# EasyEDA Pro project ACS DIN Controller.eprj, board Main Board
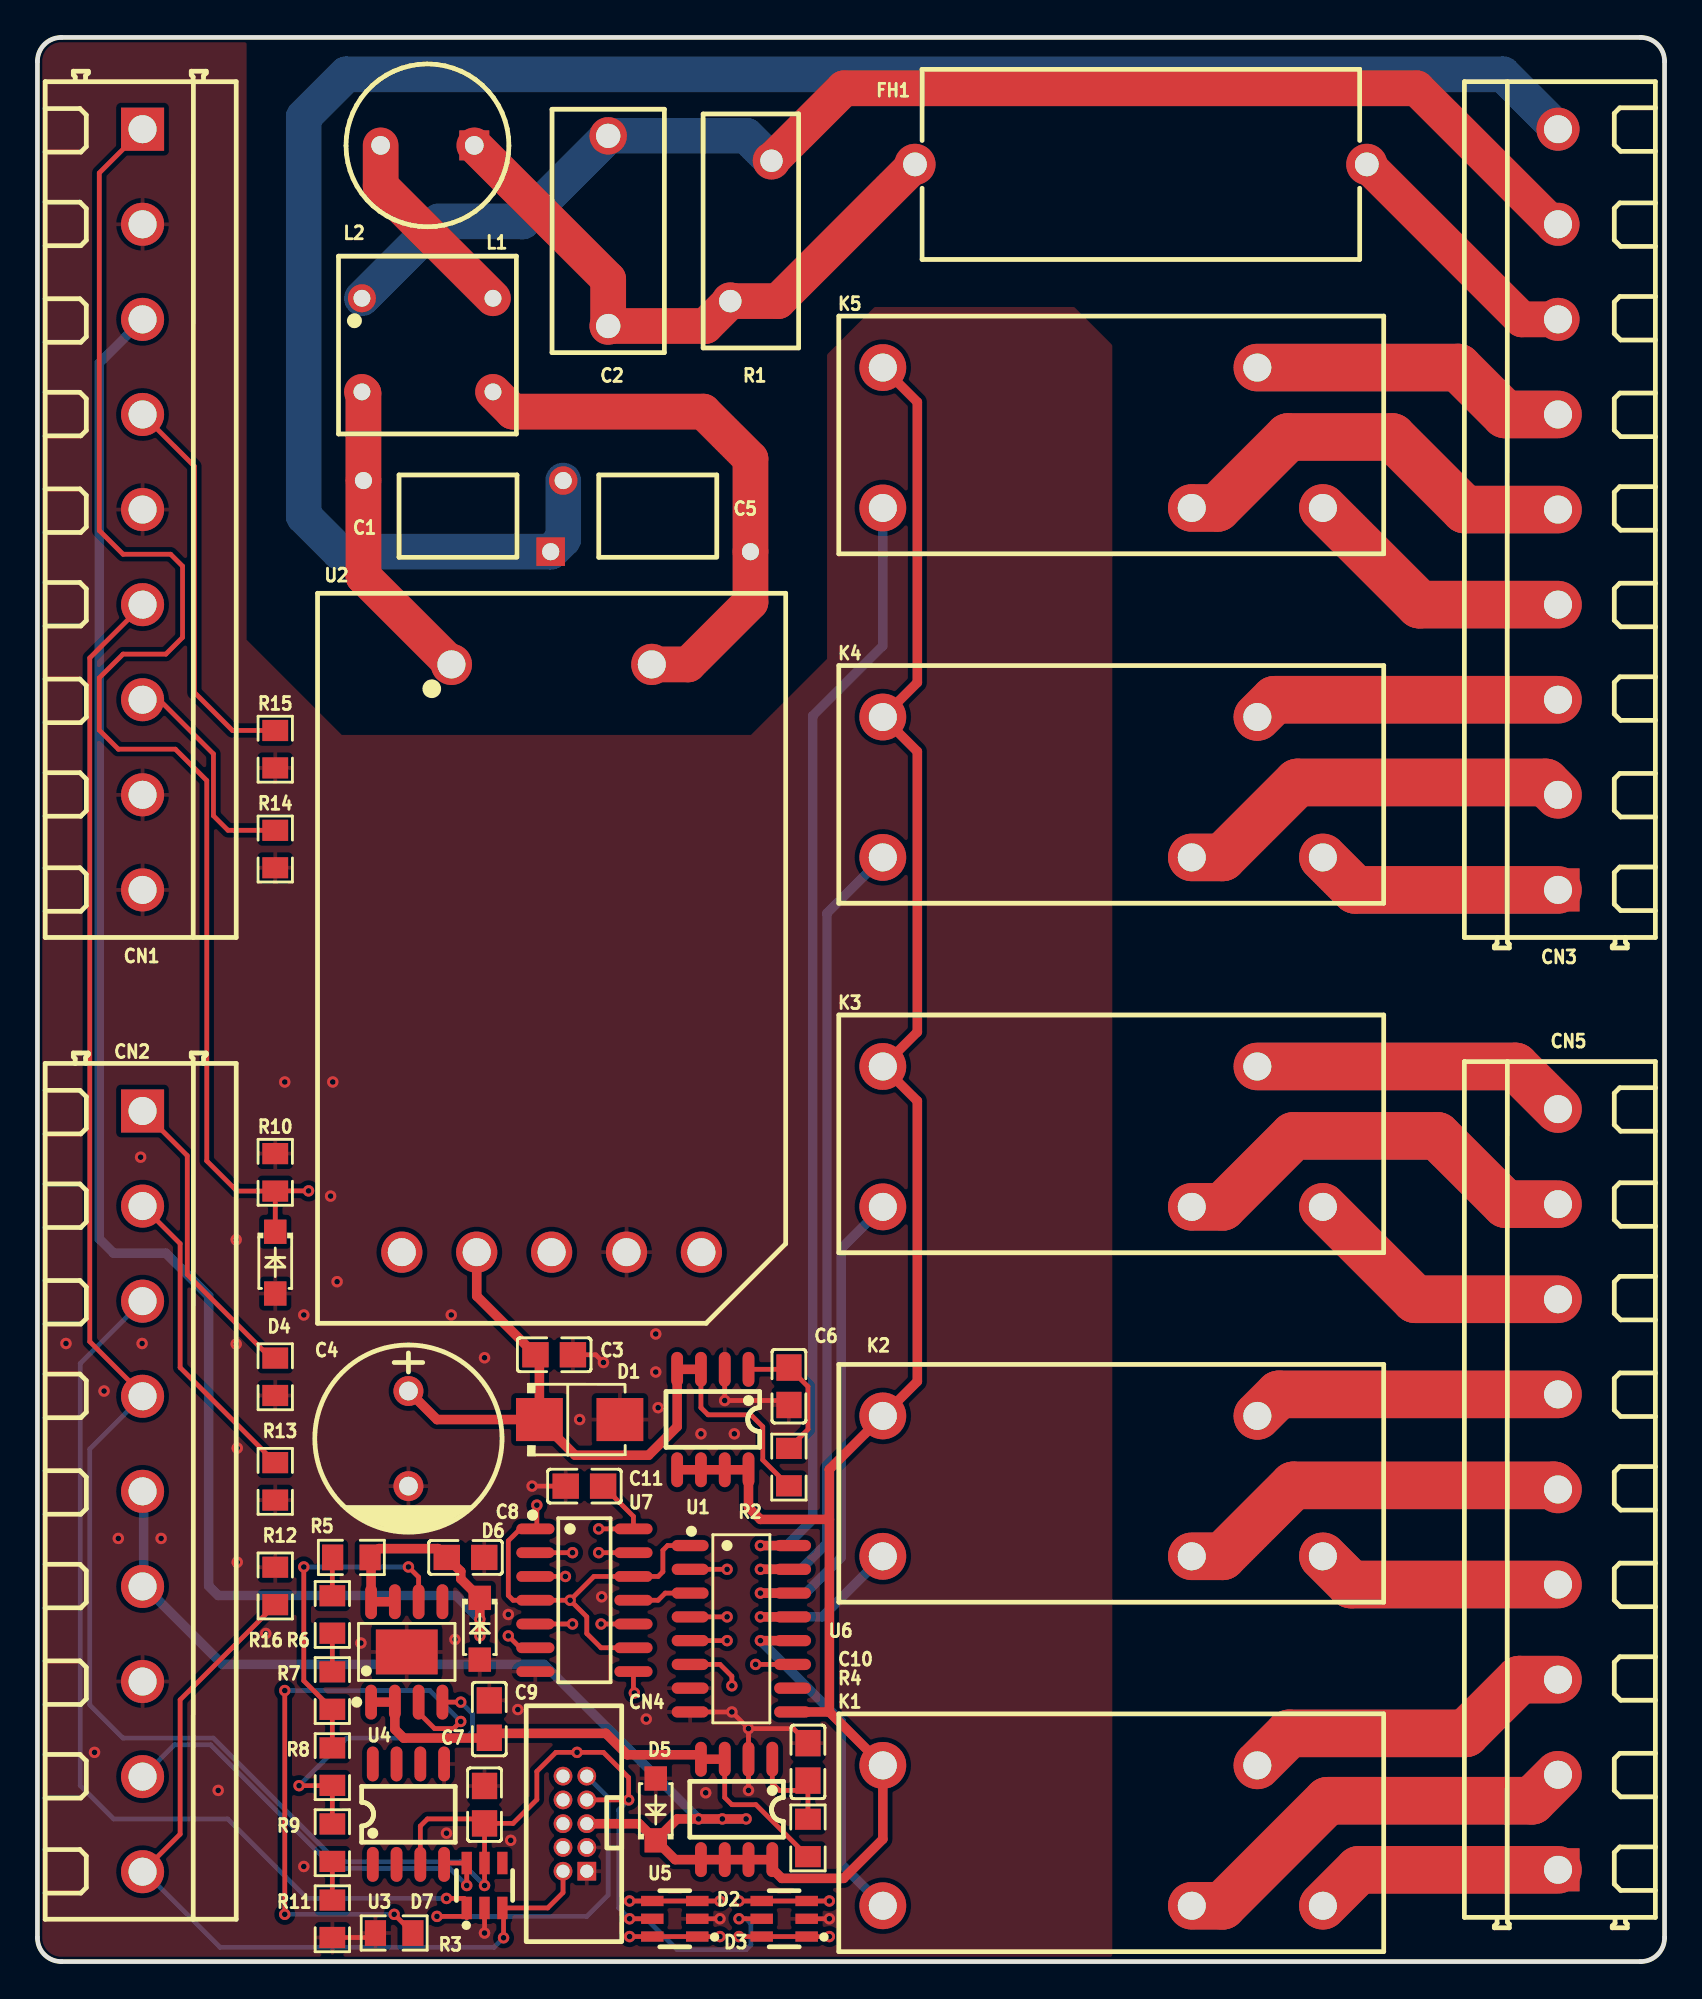
[diagram p2: board, top side]
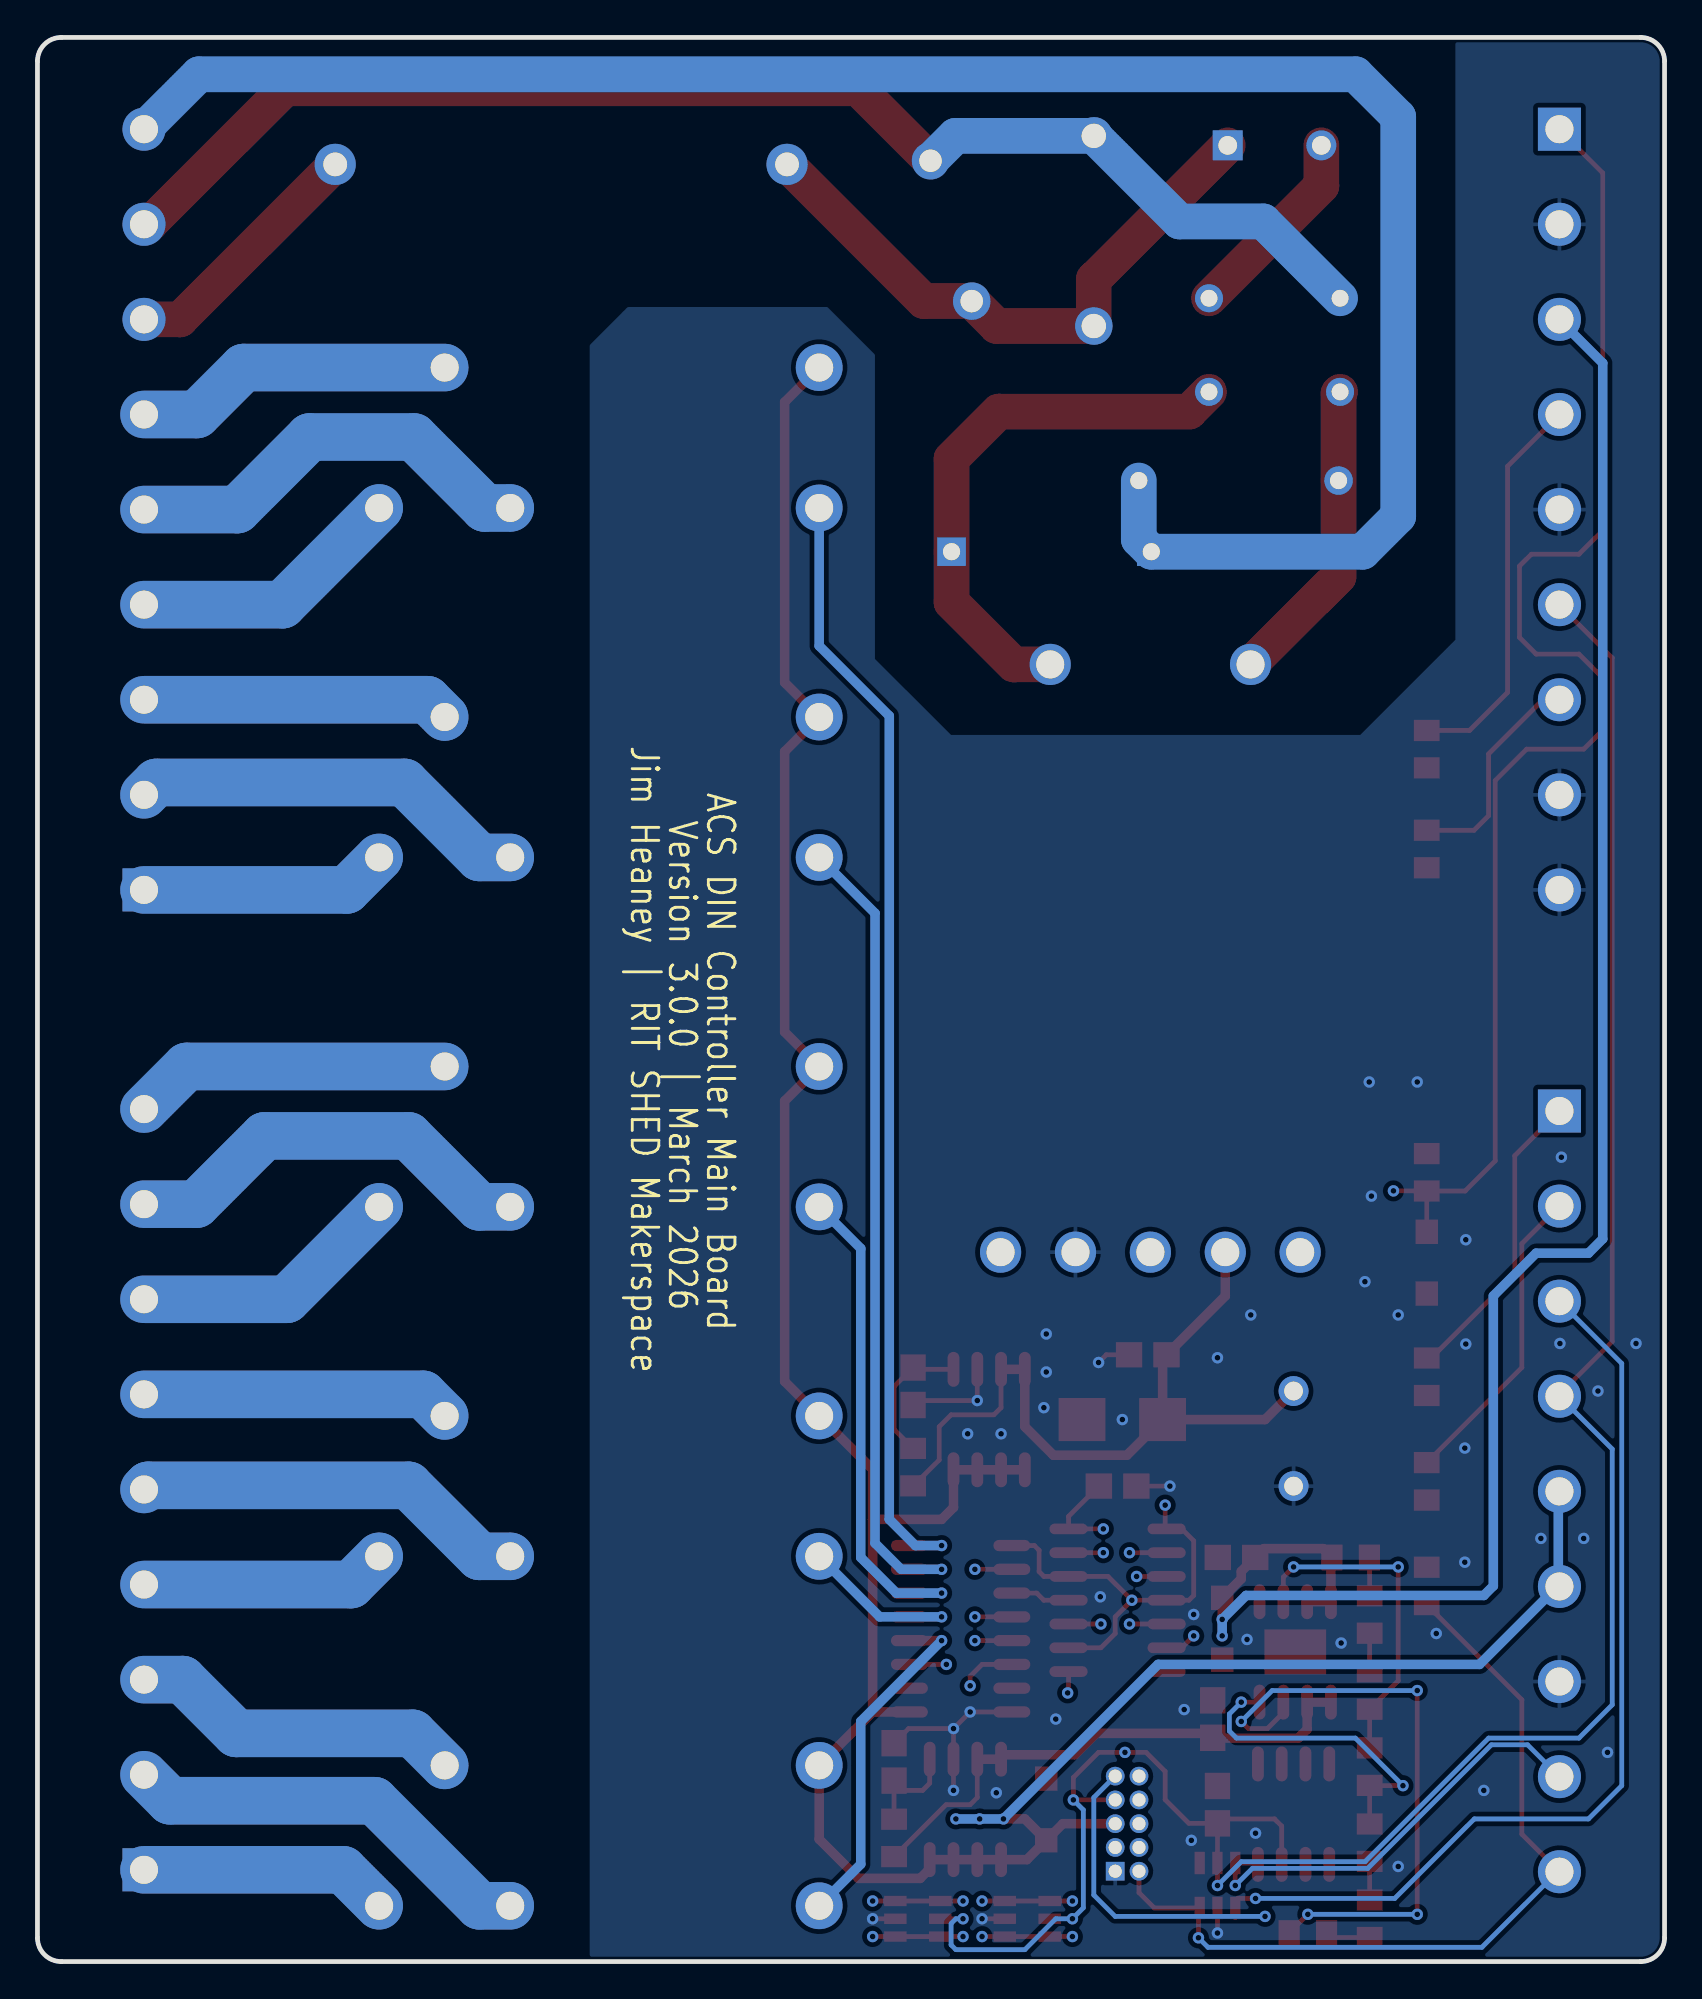
[diagram p3: board, bottom side, seen from below]

Outline 86.89 x 102.79 mm; copper layers: Top Layer, Inner1, Inner2, Bottom Layer. Coordinates in mm from the lower left corner of the outline.
Outline path: 0,101.52 0,1.27 arc(0.37,0.37) 1.27,0 85.62,0 arc(86.52,0.37) 86.89,1.27 86.89,101.52 arc(86.52,102.42) 85.62,102.79 1.27,102.79 arc(0.37,102.42) 0,101.52
Stack: Top Layer 0.035mm Outer layer thickness 1oz / Dielectric1 0.2104mm 7628 RC49% 8.6mil / Inner1 0.0152mm Inner layer thickness / Dielectric2 1.065mm 1.1mm H/HOZ Copper / Inner2 0.0152mm Inner layer thickness / Dielectric3 0.2104mm 7628 RC49% 8.6mil / Bottom Layer 0.035mm Outer layer thickness 1oz

## Design rules (mm)
template: Custom Config
spacing copperThickness1oz (default): track to track 0.102, other pairs 0.152 to 0.3
spacing copperThickness2oz: track to track 0.203, other pairs 0.152 to 0.3
spacing 350V Spacing: track to track 0.762, other pairs 0.152 to 1.524
track width copperThickness1oz (default): min 0.127, default 0.254, max 2.54
track width copperThickness2oz: min 0.203, default 0.254, max 2.54
differential pair differentialPair (default): width min 0.127, default 0.254, max 2.54; gap min 0.152, default 0.152
via viaSize (default): diameter min 0.5, default 0.61, max 10; hole min 0.3, default 0.305, max 6.3
net NC4 uses 350V Spacing
net COM4 uses 350V Spacing
net NO4 uses 350V Spacing
net NC3 uses 350V Spacing
net COM3 uses 350V Spacing
net NO3 uses 350V Spacing
net NC2 uses 350V Spacing
net COM2 uses 350V Spacing
net NO2 uses 350V Spacing
net NC1 uses 350V Spacing
net COM1 uses 350V Spacing
net NO1 uses 350V Spacing
net NEUTRAL uses 350V Spacing
net EARTH uses 350V Spacing
net LIVE uses 350V Spacing
net NC uses 350V Spacing
net NO uses 350V Spacing
net COM uses 350V Spacing

## Placement (name value [footprint] x y rotation side)
C1  1nF  [CAP-TH_L6.3-W4.4-P10.00-D0.6-S3.8]  22.41 77.22 180 top
C2  100nF  [CAP-TH_L13.0-W6.0-P10.00-D1.0]  30.48 92.46 270 top
C3  1uF  [C0805]  27.6 32.42 180 top
C4  470uF  [CAP-TH_BD10.0-P5.00-D1.0-FD]  19.81 27.94 270 top
C5  1nF  [CAP-TH_L6.3-W4.4-P10.00-D0.6-S3.8]  33.08 77.22 180 top
C6  100nF  [C0805]  40.13 30.73 270 top
C7  100nF  [C0805]  23.88 8.38 270 top
C8  1uF  [C0805]  22.86 21.59 180 top
C9  1uF  [C0805]  24.13 12.95 270 top
C10  100nF  [C0805]  41.15 10.67 90 top
C11  100nF  [C0805]  29.21 25.4 0 top
CN1  DB128V-5.08-9P-GN-S  [CONN-TH_9P-P5.08_DIBO_DB128V-5.08-9P-GN-S]  5.61 77.57 270 top
CN2  DB128V-5.08-9P-GN-S  [CONN-TH_9P-P5.08_DIBO_DB128V-5.08-9P-GN-S]  5.61 25.12 270 top
CN3  DB128V-5.08-9P-GN-S  [CONN-TH_9P-P5.08_DIBO_DB128V-5.08-9P-GN-S]  81.2 77.57 90 top
CN4  X1270WV-2x05B-9TV01  [IDC-TH_10P-P1.27-X1270WV-2X05A-6TV01]  28.7 7.37 90 top
CN5  DB128V-5.08-9P-GN-S  [CONN-TH_9P-P5.08_DIBO_DB128V-5.08-9P-GN-S]  81.2 25.22 90 top
D1  SMBJ15A  [SMB_L4.3-W3.6-LS5.3-RD]  28.96 28.96 0 top
D2  SRV05-4  [SOT-23-6_L2.9-W1.6-P0.95-LS2.8-BL-1]  34.04 2.29 90 top
D3  SRV05-4  [SOT-23-6_L2.9-W1.6-P0.95-LS2.8-BL-1]  39.88 2.29 90 top
D4  SMF12A  [SOD-123FL_L2.8-W1.8-LS3.8-R-RD]  12.7 37.34 270 top
D5  SMF12A  [SOD-123FL_L2.8-W1.8-LS3.8-R-RD]  33.02 8.13 90 top
D6  SMF12A  [SOD-123FL_L2.8-W1.8-LS3.8-R-RD]  23.62 17.78 270 top
D7  SRV05-4  [SOT-23-6_L2.9-W1.6-P0.95-LS2.8-BL-1]  23.88 4.06 0 top
FH1  05200101Z  [BAT-TH_05200101Z]  58.93 96.01 180 top
K1  G2RL-1-DC12  [RELAY-TH_G2RL-1-DCXX]  56.9 6.73 0 top
K2  G2RL-1-DC12  [RELAY-TH_G2RL-1-DCXX]  56.9 25.4 0 top
K3  G2RL-1-DC12  [RELAY-TH_G2RL-1-DCXX]  56.9 44.07 0 top
K4  G2RL-1-DC12  [RELAY-TH_G2RL-1-DCXX]  56.9 62.74 0 top
K5  G2RL-1-DC12  [RELAY-TH_G2RL-1-DCXX]  56.9 81.41 0 top
L1  EE8.3-15mH  [XFMR-TH_4P-L9.5-W9.5_EE8.3-10MH]  20.83 86.36 270 top
L2  470uH  [IND-TH_BD8.7-P5.0-D0.7_RLB0914]  20.83 97.03 180 top
R1  210pF@1kHz  [RES-TH_L12.5-W5.1-P7.50-D1.2-S2.20]  38.1 92.46 90 top
R2  390Ω  [R0805]  40.13 26.42 90 top
R3  20kΩ  [R0805]  19.05 1.52 180 top
R4  390Ω  [R0805]  41.15 6.6 90 top
R5  100kΩ  [R0805]  16.76 21.59 0 top
R6  20kΩ  [R0805]  15.75 18.54 90 top
R7  20kΩ  [R0805]  15.75 14.48 90 top
R8  10kΩ  [R0805]  15.75 10.41 90 top
R9  10kΩ  [R0805]  15.75 6.35 90 top
R10  10kΩ  [R0805]  12.7 42.16 270 top
R11  5.1kΩ  [R0805]  15.75 2.29 90 top
R12  20kΩ  [R0805]  12.7 25.65 90 top
R13  20kΩ  [R0805]  12.7 31.24 90 top
R14  20kΩ  [R0805]  12.7 59.44 90 top
R15  20kΩ  [R0805]  12.7 64.77 90 top
R16  20kΩ  [R0805]  12.7 20.07 270 top
U1  MX5052S  [SOP-8_L4.9-W3.9-P1.27-LS6.0-BL]  36.07 28.96 180 top
U2  TAS20-12-W2  [PWRM-TH_4P-L39.0-W25.0_TAS12-15-W2]  27.46 53.6 270 top
U3  DS18B20Z(UMW)  [SOP-8_L4.9-W3.9-P1.27-LS6.0-BL]  19.81 7.87 0 top
U4  MX25947ES  [ESOP-8_L4.9-W3.9-P1.27-LS6.0-BL-EP-1]  19.72 16.54 0 top
U5  MX5052S  [SOP-8_L4.9-W3.9-P1.27-LS6.0-BL]  37.34 8.13 180 top
U6  ULN2003ADR  [SOIC-16_L9.9-W3.9-P1.27-LS6.0-BL]  37.59 17.78 270 top
U7  74HC08D,653  [SOIC-14_L8.7-W3.9-P1.27-LS6.0-BL]  29.21 19.3 270 top

## Footprints (pads in the part's own frame, mm; a bottom-side part is the same pattern mirrored in y, then rotated)
BAT-TH_05200101Z
  round 2.2 hole 1.27: 1(-12.065,0) 2(12.065,0)
C0805
  rect 1.41x1.35 smd: 1(-1,0) 2(1,0)
CAP-TH_BD10.0-P5.00-D1.0-FD
  round 1.6 hole 1: 1(-2.54,0) 2(2.54,0)
CAP-TH_L6.3-W4.4-P10.00-D0.6-S3.8
  rect 1.524x1.524 hole 0.914: 1(-5,1.9)
  round 1.524 hole 0.914: 2(5,-1.9)
CAP-TH_L13.0-W6.0-P10.00-D1.0
  round 2 hole 1.3: 1(-5.08,0) 2(5.08,0)
CONN-TH_9P-P5.08_DIBO_DB128V-5.08-9P-GN-S
  rect 2.3x2.3 hole 1.5: 1(-20.32,0)
  round 2.3 hole 1.5: 2(-15.24,0) 3(-10.16,0) 4(-5.08,0) 5(0,0) 6(5.08,0) 7(10.16,0) 8(15.24,0) 9(20.32,0)
ESOP-8_L4.9-W3.9-P1.27-LS6.0-BL-EP-1
  oval 0.63x1.865 smd: 1(-1.905,-2.683) 2(-0.635,-2.683) 3(0.635,-2.683) 4(1.905,-2.683) 5(1.905,2.683) 6(0.635,2.683) 7(-0.635,2.683) 8(-1.905,2.683)
  rect 3.3x2.4 smd: 9(0,0)
IDC-TH_10P-P1.27-X1270WV-2X05A-6TV01
  rect 1x1 hole 0.7: 1(-2.54,-0.635)
  round 1 hole 0.7: 2(-2.54,0.635) 3(-1.27,-0.635) 4(-1.27,0.635) 5(0,-0.635) 6(0,0.635) 7(1.27,-0.635) 8(1.27,0.635) 9(2.54,-0.635) 10(2.54,0.635)
IND-TH_BD8.7-P5.0-D0.7_RLB0914
  rect 1.6x1.6 hole 1: 1(-2.5,0)
  round 1.6 hole 1: 2(2.5,0)
PWRM-TH_4P-L39.0-W25.0_TAS12-15-W2
  round 2.2 hole 1.5: 1(-15.7,-5.35) 2(-15.7,5.35) 3(15.7,8) 4(15.7,4) 5(15.7,0) 6(15.7,-4) 7(15.7,-8)
R0805
  rect 1.133x1.377 smd: 1(-1,0) 2(1,0)
RELAY-TH_G2RL-1-DCXX
  round 2.5 hole 1.5: 1(-11.75,-3.75) 2(4.75,-3.75) 3(11.75,-3.75) 4(8.25,3.75) 5(-11.75,3.75)
RES-TH_L12.5-W5.1-P7.50-D1.2-S2.20
  round 2 hole 1.2: 1(-3.749,1.1) 2(3.749,-1.1)
SMB_L4.3-W3.6-LS5.3-RD
  rect 2.5x2.3 smd: 1(-2.15,0) 2(2.15,0)
SOD-123FL_L2.8-W1.8-LS3.8-R-RD
  rect 1.3x1.2 smd: 1(1.65,0) 2(-1.65,0)
SOIC-14_L8.7-W3.9-P1.27-LS6.0-BL
  oval 0.574x2.038 smd: 1(-3.81,-2.619) 2(-2.54,-2.619) 3(-1.27,-2.619) 4(0,-2.619) 5(1.27,-2.619) 6(2.54,-2.619) 7(3.81,-2.619) 8(3.81,2.619) 9(2.54,2.619) 10(1.27,2.619) 11(0,2.619) 12(-1.27,2.619) 13(-2.54,2.619) 14(-3.81,2.619)
SOIC-16_L9.9-W3.9-P1.27-LS6.0-BL
  oval 0.602x1.971 smd: 1(-4.445,-2.736) 2(-3.175,-2.736) 3(-1.905,-2.736) 4(-0.635,-2.736) 5(0.635,-2.736) 6(1.905,-2.736) 7(3.175,-2.736) 8(4.445,-2.736) 9(4.445,2.736) 10(3.175,2.736) 11(1.905,2.736) 12(0.635,2.736) 13(-0.635,2.736) 14(-1.905,2.736) 15(-3.175,2.736) 16(-4.445,2.736)
SOP-8_L4.9-W3.9-P1.27-LS6.0-BL
  oval 0.63x1.865 smd: 1(-1.905,-2.683) 2(-0.635,-2.683) 3(0.635,-2.683) 4(1.905,-2.683) 5(1.905,2.683) 6(0.635,2.683) 7(-0.635,2.683) 8(-1.905,2.683)
SOT-23-6_L2.9-W1.6-P0.95-LS2.8-BL-1
  rect 0.55x1.2 smd: 1(-0.95,-1.2) 2(0,-1.2) 3(0.95,-1.2) 4(0.95,1.2) 5(0,1.2) 6(-0.95,1.2)
XFMR-TH_4P-L9.5-W9.5_EE8.3-10MH
  round 1.5 hole 0.9: 1(-2.5,-3.5) 2(2.5,-3.5) 3(2.5,3.5) 4(-2.5,3.5)

## Nets
As in the schematic.

Pads without a net: D7 4; U2 3 5 7; U3 1 2 6 7 8; U4 5; U6 10

## Via types
v1: diameter 0.61, hole 0.305, Top Layer to Bottom Layer, 96 vias

## Routing (per net, layer and track width the routed paths; a pad name or vN(x,y) marks a point on that pad's centre or on a via; arc(x,y) is an arc through that point)
+5V: length 146.3
  Top Layer w0.254: 20.45,5.95 20.45,7.24 20.83,7.62 23.64,7.62 C7.2 ; C11.2 31.83,23.78 U7.14 v1(29.97,23.11) ; D2.5 v1(31.62,2.29) ; 5.66,72.52 2.79,69.65 2.79,33.12 5.66,30.25 ; CN4.7 v1(31.57,8.64) 31.57,9.83 30.23,11.18 v1(28.82,11.18) 27.69,11.18 26.67,10.16 26.67,8.65 25.4,7.38 C7.2 ; C7.2 D7.5 v1(23.88,4.06) ; D3.5 v1(37.47,2.29)
  Inner1 w0.508: v1(28.82,11.18) 28.82,13.58 30.99,15.75 30.99,22.1 v1(29.97,23.11)
  Bottom Layer w0.254: v1(31.57,8.64) 31.04,8.1 31.04,2.87 v1(31.62,2.29) 32.51,2.29 34.16,0.63 37.85,0.63 38.1,0.89 38.1,2.03 37.85,2.29 v1(37.47,2.29) ; 5.66,30.25 2.79,27.38 2.79,13.72 4.57,11.94 9.39,11.94 16,5.33 22.61,5.33 v1(23.88,4.06)
+12V: length 163.8
  Top Layer w0.508: 42.29,13.34 U6.9 ; 42.29,13.34 42.29,23.62 ; 42.29,13.34 K1.5 45.15,6.54 43.05,4.44 39.75,4.44 39.24,4.95 U5.8 U5.7 U5.6 U5.5 34.05,5.45 D5.2 ; U1.5 U1.7 U1.8 37.97,24.26 38.61,23.62 42.29,23.62 ; 42.29,23.62 42.29,26.3 K2.5 46.99,30.99 46.99,45.97 45.15,47.82 ; D5.2 32.13,7.37 CN4.5 ; D5.2 34.16,7.62 v1(35.31,7.62) v1(36.58,7.62) v1(37.85,7.62) ; K3.5 46.99,49.66 46.99,64.64 K4.5 46.99,68.33 46.99,83.31 K5.5
  Bottom Layer w0.508: v1(37.85,7.62) v1(36.58,7.62) v1(35.31,7.62) 27.05,15.88 9.88,15.88 5.66,20.09 5.67,20.1 5.67,25.16 5.66,25.17
GND: length 25.2
  Top Layer w0.254: v1(30.23,32) 29.81,32.42 C3.1 ; v1(37.97,12.45) 40.37,12.45 C10.2 ; v1(37.97,12.45) U5.2 v1(37.97,9.14) ; v1(37.97,12.45) v1(37.08,13.34) U6.8 ; C6.2 39.89,29.97 v1(36.7,29.97) U1.2 ; C11.1 v1(26.42,25.4) ; D2.2 v1(36.45,2.29) ; D3.2 v1(42.29,2.29) ; D7.2 v1(23.88,1.52) ; R11.1 17.81,1.29 R3.2
  vias: v1(1.52,33.02) v1(3.05,11.18) v1(3.56,30.48) v1(4.32,22.61) v1(5.51,42.97) v1(5.59,33.02) v1(6.6,22.61) v1(9.65,9.14) v1(10.61,38.56) v1(10.61,32.99) v1(10.67,27.43) v1(10.67,21.34) v1(12.19,17.53) v1(13.21,46.99) v1(14.22,34.54) v1(14.22,5.08) v1(15.66,40.89) v1(15.77,46.99) v1(16,36.32) v1(17.27,17.02) v1(21.84,6.86) v1(22.1,34.54) v1(22.3,17.21) v1(23.88,32.26) v1(25.15,18.54) v1(25.27,6.48) v1(25.65,13.46) v1(28.96,28.96) v1(30.13,19.49) v1(32.51,12.95) v1(33.02,33.53) v1(33.02,31.5) v1(33.15,29.59) v1(35.43,28.19) v1(35.69,9.02) v1(37.22,28.19)
VIN: length 101.9
  Top Layer w0.508: v1(23.63,17.4) v1(23.63,18.28) 23.63,19.43 D6.2 22.61,20.45 22.61,20.84 C8.2 21.39,22.06 18.23,22.06 R5.2 17.82,21.54 U4.8 19.09,19.22
  Bottom Layer w0.508: v1(23.63,17.4) v1(23.63,18.28) 22.35,19.56 9.65,19.56 9.14,20.07 9.14,35.56 6.86,37.85 4.06,37.85 3.3,38.61 3.3,85.39 5.66,87.76
ACCESS: length 98
  Top Layer w0.254: R16.2 7.62,13.99 7.62,6.81 CN2.9 ; v1(26.67,24.38) 26.67,23.19 U7.1 25.78,23.11 25.15,22.48 25.15,19.56 25.4,19.3 U7.4 v1(28.45,19.3) ; CN4.2 28.07,3.68 27.25,2.86 D7.3 24.89,2.8 v1(24.89,1.27) ; U7.9 30.1,16.76 29.34,17.53 29.34,18.41 v1(28.45,19.3) ; v1(28.45,19.3) 29.72,20.57 U7.12 33.15,20.57 33.4,20.83 33.4,21.97 33.66,22.22 U6.1
  Inner1 w0.254: 12.7,24.13 13.21,23.62 22.86,23.62 23.62,24.38 v1(26.67,24.38) ; v1(28.45,19.3) 27.94,18.8 27.94,15.75 26.64,14.45 26.64,11.39 26.11,10.86 26.11,6.78 CN4.2
  Bottom Layer w0.254: 5.66,4.85 9.75,0.76 24.38,0.76 v1(24.89,1.27)
CH0: length 60.7
  Top Layer w0.508: U6.16 v1(38.61,22.22)
  Bottom Layer w0.508: v1(38.61,22.22) 40,22.22 41.4,23.62 41.4,66.55 45.15,70.29 K5.1
CH1: length 43.7
  Top Layer w0.508: U6.15 v1(38.61,20.96)
  Bottom Layer w0.508: v1(38.61,20.96) 40.77,20.96 42.16,22.35 42.16,56.01 K4.1
CH2: length 26.5
  Top Layer w0.508: U6.14 v1(38.61,19.69)
  Bottom Layer w0.508: v1(38.61,19.69) 41.02,19.69 42.93,21.59 42.93,38.1 K3.1
CH3: length 9.6
  Top Layer w0.508: U6.13 v1(38.61,18.41)
  Bottom Layer w0.508: v1(38.61,18.41) 41.91,18.41 K2.1
CH4: length 18.6
  Top Layer w0.508: U6.12 v1(38.61,17.15)
  Bottom Layer w0.508: K1.1 42.93,5.2 42.93,12.83 v1(38.61,17.15)
COM: length 68.4
  Top Layer w2.54: K5.4 75.88,85.16 78.38,82.65 CN3.6
  Inner1 w2.54: K5.4 75.88,85.16 78.38,82.65 CN3.6
  Inner2 w2.54: K5.4 75.88,85.16 78.38,82.65 CN3.6
  Bottom Layer w2.54: K5.4 75.88,85.16 78.38,82.65 CN3.6
COM1: length 71.8
  Top Layer w2.54: K1.4 66.86,12.19 76.27,12.19 79.14,15.06 CN5.3
  Inner1 w2.54: CN5.3 79.14,15.06 76.27,12.19 66.86,12.19 K1.4
  Inner2 w2.54: CN5.3 79.14,15.06 76.27,12.19 66.86,12.19 K1.4
  Bottom Layer w2.54: CN5.3 79.14,15.06 76.27,12.19 66.86,12.19 K1.4
COM2: length 66.1
  Top Layer w2.54: K2.4 66.3,30.3 CN5.6
  Inner1 w2.54: CN5.6 66.3,30.3 K2.4
  Inner2 w2.54: K2.4 66.3,30.3 CN5.6
  Bottom Layer w2.54: K2.4 66.3,30.3 CN5.6
COM3: length 68
  Top Layer w2.54: CN5.9 78.93,47.82 K3.4
  Inner1 w2.54: CN5.9 78.93,47.82 K3.4
  Inner2 w2.54: CN5.9 78.93,47.82 K3.4
  Bottom Layer w2.54: K3.4 78.93,47.82 CN5.9
COM4: length 65.8
  Top Layer w2.54: K4.4 66.07,67.41 CN3.3
  Inner1 w2.54: K4.4 66.07,67.41 CN3.3
  Inner2 w2.54: CN3.3 66.07,67.41 K4.4
  Bottom Layer w2.54: CN3.3 66.07,67.41 K4.4
EARTH: length 325.6
  Inner1 w1.905: CN3.9 78.27,100.83 16.5,100.83 14.22,98.55 14.22,77.22 16.12,75.32 C1.1 28.08,75.99 C5.2
  Inner2 w1.905: CN3.9 78.27,100.83 16.5,100.83 14.22,98.55 14.22,77.22 16.12,75.32 C1.1 28.08,75.99 C5.2
  Bottom Layer w1.905: CN3.9 78.27,100.83 16.5,100.83 14.22,98.55 14.22,77.22 16.12,75.32 C1.1 28.08,75.99 C5.2
GPIO1: length 114.6
  Top Layer w0.254: v1(36.45,1.34) D2.1 D2.6 v1(31.62,1.34) ; R12.2 7.62,31.73 7.62,38.35 CN2.2 ; U7.10 v1(30.1,18.03)
  Inner1 w0.254: v1(31.62,1.34) 30.79,1.34 30.14,0.69 10.24,0.69 7.37,3.56 7.37,38.71 5.66,40.41 ; v1(30.1,18.03) 30.1,15.88 28.07,13.84 CN4.10
  Inner2 w0.254: CN4.10 26.11,7.95 26.11,3.88 27.19,2.79 30.35,2.79 31.5,3.94 32.52,3.94 35.12,1.34 v1(36.45,1.34)
GPIO2: length 124.3
  Top Layer w0.254: 5.62,45.45 CN2.1 8,43.05 8,36.7 12.46,32.24 R13.2 ; v1(29.97,21.84) U7.13 ; v1(31.62,3.24) D2.4 D2.3 v1(36.45,3.24)
  Inner1 w0.254: v1(31.62,3.24) 31.18,3.24 30.73,2.79 30.73,1.79 29.99,1.04 26.39,1.04 25.32,2.11 22.93,2.11 21.86,1.04 10.38,1.04 7.72,3.7 7.72,43.43 5.66,45.49 ; CN4.8 27.18,9.53 27.18,10.41 27.71,10.95 27.71,13.99 29.51,15.79 29.51,21.39 v1(29.97,21.84)
  Inner2 w0.254: CN4.8 26.47,7.03 26.47,4.02 27.34,3.15 30.21,3.15 31.35,4.29 32.66,4.29 33.72,3.24 v1(36.45,3.24)
GPIO3: length 148.6
  Top Layer w0.254: v1(42.29,3.24) D3.3 D3.4 v1(37.47,3.24) ; v1(28.57,18.03) U7.5 ; CN1.7 6.5,67.41 9.4,64.52 9.4,61.21 10.18,60.44 R14.2
  Inner1 w0.254: CN4.4 26.47,7.7 26.47,10.71 27,11.24 27,14.29 28.57,15.86 v1(28.57,18.03) ; v1(37.47,3.24) 36.88,3.82 31.26,3.82 30.38,2.94 30.38,1.93 29.84,1.4 26.54,1.4 25.47,2.46 22.78,2.46 21.71,1.4 10.53,1.4 8.08,3.85 8.08,65.02 5.66,67.44
  Inner2 w0.254: v1(42.29,3.24) 39.18,3.24 38.12,4.29 33.67,4.29 32.96,5 31.06,5 29.91,3.86 27.63,3.86 27.18,4.32 27.18,5.21 CN4.4
GPIO4: length 181.1
  Top Layer w0.254: v1(42.29,1.34) D3.1 D3.6 v1(37.47,1.34) ; R15.2 10.41,65.77 8.38,67.8 8.38,79.88 CN1.4 ; U7.2 v1(28.57,21.84)
  Inner1 w0.254: CN4.6 26.82,8.61 26.82,10.56 27.35,11.09 27.35,14.14 29.16,15.94 29.16,21.26 v1(28.57,21.84) ; 5.66,82.68 8.43,79.91 8.43,4 10.68,1.75 21.57,1.75 22.63,2.82 25.62,2.82 26.69,1.75 29.69,1.75 30.02,2.08 30.02,3.09 31.11,4.18 37.48,4.18 38.1,3.56 38.1,1.97 v1(37.47,1.34)
  Inner2 w0.254: CN4.6 26.82,6.12 26.82,4.17 27.49,3.51 30.06,3.51 31.2,4.65 32.81,4.65 33.52,3.94 37.97,3.94 40.57,1.34 v1(42.29,1.34)
INTERRUPT: length 84.7
  Top Layer w0.254: v1(21.84,3.37) 22.79,3.37 22.93,3.24 D7.1 22.93,2.35 22.87,2.41 v1(21.34,2.41) ; v1(38.35,15.88) U6.11
  Inner2 w0.254: CN4.9 30.99,9.91 33.15,12.06 33.15,15.12 33.65,15.62 38.1,15.62 v1(38.35,15.88)
  Bottom Layer w0.254: 5.66,35.33 2.29,31.95 2.29,9.4 4.06,7.62 10.16,7.62 14.41,3.37 v1(21.84,3.37) ; v1(21.34,2.41) 29.34,2.41 30.48,3.56 30.48,8.76 CN4.9
INTERRUPT-IN: length 120.6
  Top Layer w0.254: 5.66,97.92 3.3,95.56 3.3,76.45 4.57,75.18 7.11,75.18 7.75,74.55 7.75,70.74 6.86,69.85 4.57,69.85 3.3,68.58 3.3,65.79 4.32,64.77 7.37,64.77 9.04,63.09 9.04,42.77 10.65,41.16 R10.2 ; R10.2 D4.2 ; R10.2 12.71,41.17 v1(14.48,41.17) ; v1(37.08,14.73) 37.08,15.24 36.45,15.88 U6.6
  Inner1 w0.254: v1(14.48,41.17) 14.48,36.32 17.53,33.27 26.67,33.27 31.5,28.45 31.5,18.03 34.8,14.73 v1(37.08,14.73)
LIVE: length 13.6
  Top Layer w1.905: CN3.7 79.27,87.73 FH1.1
NC: length 90.9
  Top Layer w2.54: K5.2 63.01,77.66 66.8,81.45 72.35,81.45 76.23,77.57 CN3.5
  Inner1 w2.54: CN3.5 76.23,77.57 72.35,81.45 66.8,81.45 63.01,77.66 K5.2
  Inner2 w2.54: K5.2 63.01,77.66 66.8,81.45 72.35,81.45 76.23,77.57 CN3.5
  Bottom Layer w2.54: CN3.5 76.23,77.57 72.35,81.45 66.8,81.45 63.01,77.66 K5.2
NC1: length 89.8
  Top Layer w2.54: CN5.2 79.81,8.59 68.9,8.59 63.29,2.98 K1.2
  Inner1 w2.54: K1.2 63.29,2.98 68.9,8.59 79.81,8.59 CN5.2
  Inner2 w2.54: K1.2 63.29,2.98 68.9,8.59 79.81,8.59 CN5.2
  Bottom Layer w2.54: CN5.2 79.81,8.59 68.9,8.59 63.29,2.98 K1.2
NC2: length 84.9
  Top Layer w2.54: K2.2 63.29,21.65 67.08,25.44 80.99,25.44 CN5.5
  Inner1 w2.54: K2.2 63.29,21.65 67.08,25.44 80.99,25.44 CN5.5
  Inner2 w2.54: K2.2 63.29,21.65 67.08,25.44 80.99,25.44 CN5.5
  Bottom Layer w2.54: K2.2 63.29,21.65 67.08,25.44 80.99,25.44 CN5.5
NC3: length 90.6
  Top Layer w2.54: CN5.8 78.41,40.46 74.76,44.11 67.08,44.11 63.29,40.32 K3.2
  Inner1 w2.54: CN5.8 78.41,40.46 74.76,44.11 67.08,44.11 63.29,40.32 K3.2
  Inner2 w2.54: CN5.8 78.41,40.46 74.76,44.11 67.08,44.11 63.29,40.32 K3.2
  Bottom Layer w2.54: CN5.8 78.41,40.46 74.76,44.11 67.08,44.11 63.29,40.32 K3.2
NC4: length 86
  Top Layer w2.54: CN3.2 80.54,62.99 67.29,62.99 63.29,58.99 K4.2
  Inner1 w2.54: CN3.2 80.54,62.99 67.29,62.99 63.29,58.99 K4.2
  Inner2 w2.54: K4.2 63.29,58.99 67.29,62.99 80.54,62.99 CN3.2
  Bottom Layer w2.54: K4.2 63.29,58.99 67.29,62.99 80.54,62.99 CN3.2
NEUTRAL: length 72.6
  Top Layer w1.905: 39.2,96.2 43.07,100.08 73.66,100.08 80.92,92.81 CN3.8
  Bottom Layer w1.905: L1.1 21.43,92.96 25.91,92.96 C2.1 37.87,97.54 39.2,96.2
NO: length 58.8
  Top Layer w2.54: K5.3 73.81,72.49 CN3.4
  Inner1 w2.54: K5.3 73.81,72.49 CN3.4
  Inner2 w2.54: K5.3 73.81,72.49 CN3.4
  Bottom Layer w2.54: K5.3 73.81,72.49 CN3.4
NO1: length 53.4
  Top Layer w2.54: K1.3 70.57,4.9 CN5.1
  Inner1 w2.54: K1.3 70.57,4.9 CN5.1
  Inner2 w2.54: K1.3 70.57,4.9 CN5.1
  Bottom Layer w2.54: CN5.1 70.57,4.9 K1.3
NO2: length 52.7
  Top Layer w2.54: K2.3 70.15,20.14 CN5.4
  Inner1 w2.54: K2.3 70.15,20.14 CN5.4
  Inner2 w2.54: CN5.4 70.15,20.14 K2.3
  Bottom Layer w2.54: CN5.4 70.15,20.14 K2.3
NO3: length 58.4
  Top Layer w2.54: CN5.7 73.58,35.38 K3.3
  Inner1 w2.54: K3.3 73.58,35.38 CN5.7
  Inner2 w2.54: K3.3 73.58,35.38 CN5.7
  Bottom Layer w2.54: CN5.7 73.58,35.38 K3.3
NO4: length 53.1
  Top Layer w2.54: K4.3 70.38,57.25 CN3.1
  Inner1 w2.54: K4.3 70.38,57.25 CN3.1
  Inner2 w2.54: K4.3 70.38,57.25 CN3.1
  Bottom Layer w2.54: CN3.1 70.38,57.25 K4.3
ONEWIRE: length 24.2
  Top Layer w0.254: 21.72,5.95 21.72,5.26 D7.6 v1(22.93,4.06)
  Bottom Layer w0.254: 5.66,9.93 7.31,11.58 9.25,11.58 15.85,4.98 22.01,4.98 v1(22.93,4.06)
OVP: length 17.1
  Top Layer w0.254: R9.2 R8.1 15.73,9.4 v1(13.97,9.4) ; U4.4 v1(22.61,13.86)
  Bottom Layer w0.254: v1(13.97,9.4) 16.51,11.94 22.86,11.94 23.24,12.32 23.24,13.22 v1(22.61,13.86)
SET1: length 14.5
  Top Layer w0.254: v1(31.88,14.35) 31.83,14.4 U7.8 ; U6.2 v1(36.83,20.96)
  Inner2 w0.254: v1(36.83,20.96) 37.59,20.19 37.59,16.51 37.08,16 33.53,16 v1(31.88,14.35)
SET2: length 3.2
  Top Layer w0.254: U7.11 33.15,19.3 33.53,19.69 U6.3
SET3: length 16.1
  Top Layer w0.254: U7.6 25.78,16.76 v1(25.15,17.4) ; v1(36.83,18.41) U6.4
  Inner2 w0.254: v1(25.15,17.4) 25.53,17.02 32.26,17.02 33.66,18.41 v1(36.83,18.41)
SET4: length 23.1
  Top Layer w0.254: U7.3 v1(28.19,20.57) ; v1(36.83,17.15) U6.5
  Inner2 w0.254: v1(36.83,17.15) 33.02,17.15 32.46,16.58 24.82,16.58 24.38,17.02 24.38,19.43 25.53,20.57 v1(28.19,20.57)
UVLO: length 18
  Top Layer w0.254: U4.6 20.36,20.54 v1(19.81,21.08) ; R8.2 R7.1 14.22,15 v1(14.22,21.08)
  Bottom Layer w0.254: v1(19.81,21.08) v1(14.22,21.08)
$1N1296: length 32.6
  Top Layer w1.905: FH1.2 39.56,88.71 R1.1 35.67,87.38 C2.2 30.48,89.88 L2.1
$1N1509: length 10.7
  Top Layer w1.905: L2.2 18.33,94.86 L1.4
$1N1600: length 29.5
  Top Layer w1.905: L1.3 25.38,82.8 35.56,82.8 38.08,80.29 C5.1 38.08,72.62 34.75,69.3 U2.2
$1N1606: length 16.5
  Top Layer w1.905: L1.2 17.41,83.78 C1.2 17.41,74 U2.1
$1N2305: length 40.6
  Top Layer w0.254: 35.43,31.64 35.43,29.59 35.81,29.21 38.1,29.21 38.74,28.57 38.74,26.8 40.12,25.42 R2.1
  Top Layer w0.508: C4.1 21.34,28.96 D1.1 ; D1.1 26.81,32.21 C3.2 23.46,35.56 U2.6 ; D1.1 28.71,27.05 32.64,27.05 34.16,28.57 U1.4 35.43,31.64
$1N2711: length 7.4
  Top Layer w0.254: U1.1 40.04,31.64 C6.1 41.15,30.72 41.15,28.43 R2.2
$1N3088: length 29.1
  Top Layer w0.254: R4.1 38.37,8.38 37.08,8.38 36.7,8.76 U5.3
  Top Layer w0.508: U5.3 U5.4 35.43,11.05 31.5,11.05 30.35,12.19 24.37,12.19 C9.2 24.11,11.94 19.56,11.94 19.09,12.41 19.09,13.86 U4.1
$1N3094: length 5.6
  Top Layer w0.254: R4.2 C10.1 40.62,9.14 39.62,9.14 39.24,9.53 U5.1
$1N3559: length 32.6
  Top Layer w0.254: R3.1 v1(19.05,2.52) ; v1(13.21,2.52) v1(13.21,14.48) ; U4.3 20.36,13.3 21.21,12.45 22.22,12.45 v1(22.61,12.83)
  Bottom Layer w0.254: v1(22.61,12.83) 20.96,14.48 v1(13.21,14.48) ; v1(19.05,2.52) v1(13.21,2.52)
$1N3866: length 2.1
  Top Layer w0.254: R5.1 15.75,21.57 R6.2
$1N3905: length 2.1
  Top Layer w0.254: R7.2 R6.1
$1N4022: length 2.1
  Top Layer w0.254: R9.1 R11.2

## Copper pours and planes (outline as drawn; the poured copper is in the pictures)
GND on Top Layer: -2.03,107.19 61.47,107.19 61.47,-6.6 -2.03,-6.6
GND on Bottom Layer: -5.59,108.2 60.45,108.2 60.45,-7.11 -5.59,-7.11
GND on Inner1: -2.54,105.66 58.93,105.66 58.93,-9.14 -2.54,-9.14
GND on Inner2: -5.08,106.17 61.47,106.17 61.47,-10.16 -5.08,-10.16

## Text on the board
Bottom Silkscreen Layer: ACS DIN Controller Main Board | Version 3.0.0 | March 2026 | Jim Heaney | RIT SHED Makerspace
